# Altium schematic sheet Sensors.SchDoc
size A4
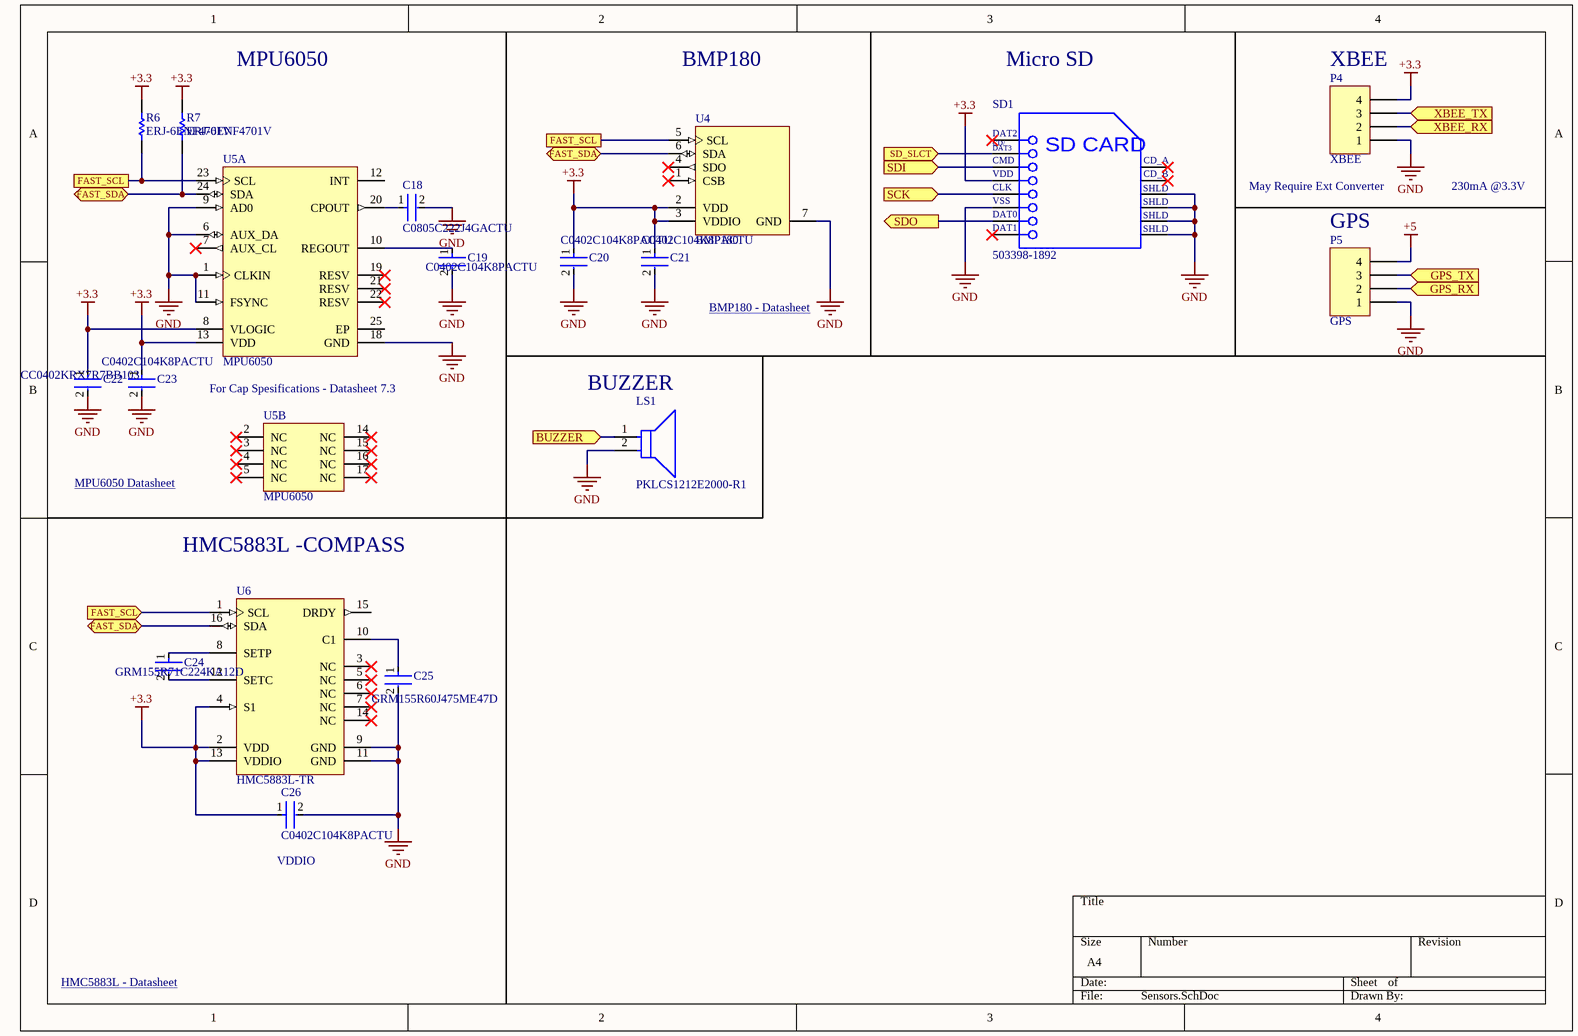
[diagram p0: Sensors.SchDoc]

## Parts
C18  C0805C222J4GACTU  [FP-C0805C-DN-MFG]
C19  C0402C104K8PACTU  [FP-C0402-BB-MFG]
C20  C0402C104K8PACTU  [FP-C0402-BB-MFG]
C21  C0402C104K8PACTU  [FP-C0402-BB-MFG]
C22  CC0402KRX7R7BB103  [FP-CC0402-MFG]
C23  C0402C104K8PACTU  [FP-C0402-BB-MFG]
C24  GRM155R71C224KA12D  [FP-GRM155-0_05-IPC_C]
C25  GRM155R60J475ME47D  [FP-GRM155-0_1-IPC_B]
C26  C0402C104K8PACTU  [FP-C0402-BB-MFG]
LS1  PKLCS1212E2000-R1  [FP-PKLCS1212E2000-R1-MFG]
P4  XBEE  [HDR1X4]
P5  GPS  [HDR1X4]
R6  ERJ-6ENF4701V  [RESC2013X70X40NL20T20]
R7  ERJ-6ENF4701V  [RESC2013X70X40NL20T20]
SD1  503398-1892  [MOLX-503398-1892_V]
U4  BMP180  [BOSC-BMP180-7_V]
U5  MPU6050  [INSE-QFN-24_V]  (parts A,B of 2)
U6  HMC5883L-TR  [HONEY-LPCC-16_V]

## Ports
BUZZER (in), FAST_SCL, FAST_SCL (in), FAST_SDA (bidir), GPS_RX (in), GPS_TX (in), SCK (in), SD_SLCT (in), SDI (in), SDO (out), XBEE_RX (in), XBEE_TX (in)

## Nets
+3.3: C20.1 C21.1 C22.1 C23.1 C26.1 P4.4 R6.2 R7.2 SD1.4(VDD) U4.2(VDD) U4.3(VDDIO) U5.8(VLOGIC) U5.13(VDD) U6.2(VDD) U6.4(S1) U6.13(VDDIO)
+5: P5.4
GND: C18.2 C19.2 C20.2 C21.2 C22.2 C23.2 C25.2 C26.2 LS1.2 P4.1 P5.1 SD1.6(VSS) SD1.11(SHLD) SD1.12(SHLD) SD1.13(SHLD) SD1.14(SHLD) U4.7(GND) U5.1(CLKIN) U5.6(AUX_DA) U5.9(AD0) U5.11(FSYNC) U5.18(GND) U6.9(GND) U6.11(GND)
BUZZER: LS1.1 ; port BUZZER
FAST_SCL: R6.1 U4.5(SCL) U5.23(SCL) U6.1(SCL) ; port FAST_SCL
FAST_SDA: R7.1 U4.6(SDA) U5.24(SDA) U6.16(SDA) ; port FAST_SDA
GPS_RX: P5.2 ; port GPS_RX
GPS_TX: P5.3 ; port GPS_TX
SCK: SD1.5(CLK) ; port SCK
SD_SLCT: SD1.2(CD/DAT3) ; port SD_SLCT
SDI: SD1.3(CMD) ; port SDI
SDO: SD1.7(DAT0) ; port SDO
XBEE_RX: P4.2 ; port XBEE_RX
XBEE_TX: P4.3 ; port XBEE_TX
NetC18_1: C18.1 U5.20(CPOUT)
NetC19_1: C19.1 U5.10(REGOUT)
NetC24_1: C24.1 U6.8(SETP)
NetC24_2: C24.2 U6.12(SETC)
NetC25_1: C25.1 U6.10(C1)

Not connected (* = marked no-connect by the designer): SD1 1(DAT2)* 8(DAT1)* 9(CD_A)* 10(CD_B)*; U4 1(CSB)* 4(SDO)*; U5 2(NC)* 3(NC)* 4(NC)* 5(NC)* 7(AUX_CL)* 12(INT) 14(NC)* 15(NC)* 16(NC)* 17(NC)* 19(RESV)* 21(RESV)* 22(RESV)* 25(EP); U6 3(NC)* 5(NC)* 6(NC)* 7(NC)* 14(NC)* 15(DRDY)

## Notes on the sheet
- MPU6050
- BMP180
- Micro SD
- (near P4) XBEE
- (near P4) May Require Ext Converter
- (near P5) GPS
- 230mA @3.3V
- BMP180 - Datasheet <https://media.digikey.com/pdf/Data%20Sheets/Bosch/BMP180.pdf?src-supplier=Digi-Key>
- (near U5) For Cap Spesifications - Datasheet 7.3
- (near LS1) BUZZER
- MPU6050 Datasheet <https://invensense.tdk.com/wp-content/uploads/2015/02/MPU-6000-Datasheet1.pdf>
- HMC5883L -COMPASS
- (near C26) VDDIO
- HMC5883L - Datasheet <https://cdn-shop.adafruit.com/datasheets/HMC5883L_3-Axis_Digital_Compass_IC.pdf>
- (in symbol CMP-2000-05621-1) CD/; DAT3; SD CARD

## Library data of the parts
C18 = CMP-03020-012538-1: Capacitor, Ceramic, 2.2Nf, 16Vdc, 5-% Tol, 5+% Tol, C0g-Tc Code, -30, 30Ppm-Tc Rohs Compliant: Yes; Manufacturer: KEMET; Voltage Rating: 16 V; Temperature Characteristic: C0G; VALUE: 2,200 pF; Tolerance: 0.05; Temperature Coefficient: 30ppm/°C; Material: Ceramic; Manufacturer Part Number: C0805C222J4GACTU; Octopart: https://octopart.com/c0805c222j4gactu-kemet-17052493; Device Class L3: Ceramic Capacitors; Temperature Range High: +125°C; Temperature Range Low: -55°C; Device Class L2: Capacitors; Package: C0805C-DN; ComponentLink2Description: Datasheet; Digikey Description: Capacitor, Ceramic, 2.2Nf, 16Vdc, 5-% Tol, 5+% Tol, C0g-Tc Code, -30, 30Ppm-Tc Rohs Compliant: Yes; ComponentLink2URL: https://content.kemet.com/datasheets/KEM_C1003_C0G_SMD.pdf; Device Class L1: Passive Components; Temperature: -55°C to +125°C; Height: 0.88mm; Capacitance: 2,200 pF; Automotive: No; RoHS: TRUE; Lead Free: Yes; Ipc Land Pattern Name: CAPC200125X78; Mouser Description: Capacitor, Ceramic, 2.2Nf, 16Vdc, 5-% Tol, 5+% Tol, C0g-Tc Code, -30, 30Ppm-Tc Rohs Compliant: Yes; Category: Cap
C19 C21 C23 C26 = CMP-2008-02046-2: CAP CER 0.1UF 10V X5R 0402; Manufacturer: Kemet; Material: Ceramic; Capacitance: 0.10 μF; Temperature Coefficient: 15%; Tolerance: 0.1; Value: 0.10 μF; Package: C0402-BB; Temperature: -55°C to +125°C; ComponentLink2Description: Datasheet; Temperature Characteristic: X5R; Device Class L1: Passive Components; Height: 0.55mm; Lead Free: Yes; ComponentLink2URL: https://content.kemet.com/datasheets/KEM_C1002_X7R_SMD.pdf; Device Class L2: Capacitors; Temperature Range Low: -55°C; Temperature Range High: +125°C; RoHS: TRUE; Octopart: https://octopart.com/c0402c104k8pactu-kemet-140039; Automotive: No; Mouser Description: Capacitor 100 nF 10 VDC 0402; Category: Cap; Voltage Rating: 10 V; Digikey Description: CAP CER 0.1UF 10V X5R 0402; Ipc Land Pattern Name: CAPC10050X50; Device Class L3: Ceramic Capacitors; Manufacturer Part Number: C0402C104K8PACTU
C20 = CMP-2008-02046-2: CAP CER 0.1UF 10V X5R 0402; Manufacturer: Kemet; Material: Ceramic; Capacitance: 0.10 μF; Temperature Coefficient: 15%; Tolerance: 0.1; VALUE: 0.10 µF; Package: C0402-BB; Temperature: -55°C to +125°C; ComponentLink2Description: Datasheet; Temperature Characteristic: X5R; Device Class L1: Passive Components; Height: 0.55mm; Lead Free: Yes; ComponentLink2URL: https://content.kemet.com/datasheets/KEM_C1002_X7R_SMD.pdf; Device Class L2: Capacitors; Temperature Range Low: -55°C; Temperature Range High: +125°C; RoHS: TRUE; Octopart: https://octopart.com/c0402c104k8pactu-kemet-140039; Automotive: No; Mouser Description: Capacitor 100 nF 10 VDC 0402; Category: Cap; Voltage Rating: 10 V; Digikey Description: CAP CER 0.1UF 10V X5R 0402; Ipc Land Pattern Name: CAPC10050X50; Device Class L3: Ceramic Capacitors; Manufacturer Part Number: C0402C104K8PACTU
C22 = CMP-03422-000501-1: CAP CER 10000PF 16V X7R 0402; Manufacturer: YAGEO; Automotive Grade: NA; Capacitance: 10 nF; Material: Ceramic; Value: 10 nF; Tolerance: 0.1; Temperature Coefficient: 30ppm/°C; Temperature Range Low: -55°C; Temperature Range High: +125°C; Mouser Description: 0402 10 nF 16 V ±10 % Tolerance X7R SMT Multilayer Ceramic Capacitor; Footprint Url: http://www.yageo.com/exep/pages/download/literatures/UPY-C_GEN_24.pdf; Category: Cap; RoHS: TRUE; Manufacturer Part Number: CC0402KRX7R7BB103; ComponentLink2Description: Datasheet; Ipc Land Pattern Name: CAPC10050X50; Automotive: No; ComponentLink2URL: http://www.yageo.com/documents/recent/UPY-GP_NP0_16V-to-50V_16.pdf; Device Class L1: Passive Components; Height: 0.55mm; Temperature Characteristic: X7R; Package: CC0402; Voltage Rating: 16 V; Device Class L3: Ceramic Capacitors; Lead Free: Yes; Device Class L2: Capacitors; Digikey Description: CAP CER 10000PF 16V X7R 0402; Octopart: https://octopart.com/cc0402krx7r7bb103-yageo-192895; Temperature: -55°C to +125°C
C24 = CMP-1034-02089-3: Chip Multilayer Ceramic Capacitors for General Purpose, 0402, 0.22uF, X7R, 15%, 10%, 16V; Capacitance: 220nF; Depth: 0.5mm; Dielectric: X7R; Min Operating Temperature: -55°C; Package Quantity: 1; Termination: SMD/SMT; Mount: Surface Mount; Radiation Hardening: No; Height: 0.5mm; Case Code (Metric): 1005; Packaging: Tape and Reel; Material: Ceramic; Voltage: 16V; Voltage Rating (DC): 16V; REACH SVHC: No SVHC; Voltage Rating: 16V; Length: 1mm; Tolerance: 10%; Thickness: 0.022inch; Case Code (Imperial): 0402; Max Operating Temperature: 125°C; Width: 0.02inch; Lead Free: Lead Free; Case/Package: 0402
C25 = CMP-2008-04549-2: Chip Multilayer Ceramic Capacitors for General Purpose, 0402, 4.7uF, X5R, 15%, 20%, 6.3V; Height: 0.5mm; Weight: 0.000212oz; Length: 1mm; Case Code (Metric): 1005; Packaging: Tape and Reel; Termination: SMD/SMT; Dielectric: X5R; Depth: 0.5mm; Case Code (Imperial): 0402; Min Operating Temperature: -55°C; Case/Package: 0402; Voltage: 6.3V; Width: 0.02inch; Capacitance: 4.7uF; Lead Free: Lead Free; Thickness: 0.022inch; Contact Plating: Tin; REACH SVHC: No SVHC; Package Quantity: 10000; Tolerance: 20%; Voltage Rating (DC): 6.3V; Voltage Rating: 6.3V; Mount: Surface Mount; Max Operating Temperature: 85°C
LS1 = CMP-06202-000001-1: AUDIO PIEZO TRANSDUCER 12.5V SMD; Manufacturer: Murata; Frequency: 2kHz; Digikey Description: AUDIO PIEZO TRANSDUCER 12.5V SMD; RoHS: TRUE; Device Class L3: Buzzers; Manufacturer Part Number: PKLCS1212E2000-R1; Automotive: No; Category: Speak; Height: 3mm; Operating Supply Voltage: 12.5V; Mouser Description: Piezo buzzer SMD; Temperature Range High: +70°C; Temperature Range Low: -20°C; ComponentLink2Description: Datasheet; ComponentLink2URL: https://www.murata.com/en-global/products/productdata/8801054425118/SPEC-PKLCS1212E2000-R1.pdf?1517839212000; Package: PKLCS1212E2000-R1; Device Class L1: Electromechanical; Device Class L2: Audio Products; Lead Free: Yes; Temperature: -20°C to +70°C; Octopart: https://octopart.com/pklcs1212e2000-r1-murata-7123179
P4 P5 = Header 4: Header, 4-Pin; LatestRevisionDate: 17-Jul-2002; LatestRevisionNote: Re-released for DXP Platform.; Publisher: Altium Limited
R6 R7 = CMP-2001-00550-5: Chip Resistor, 4.7 KOhm, +/- 1%, 0.125 W, -55 to 155 degC, 0805 (2012 Metric), RoHS, Tape and Reel; Manufacturer: Panasonic; Voltage Rating: 150 V; Min Operating Temperature: -55 degC; PackageReference: 0805; Mounting Technology: Surface Mount; Height: 0.6 mm; PackageDescription: 2-Pin Surface Mount Device, Body 2 x 1.25 mm; RoHSCompliant: true; Length: 2 mm; REACH SVHC: Yes; Packaging: Tape and Reel; Pins: 2; Mount: Surface Mount; ComponentLink2Description: Datasheet; ComponentLink1URL: http://www.panasonic.com/; ComponentLink1Description: Manufacturer URL; DatasheetVersion: 04/2015; Package Quantity: 5000; ComponentLink2URL: http://industrial.panasonic.com/cdbs/www-data/pdf/RDA0000/AOA0000C86.pdf; Max Operating Temperature: 155 degC
SD1 = CMP-2000-05621-1: Micro SD Connector, Pitch 1.1 mm, 8 Position, Height 1.4 mm, -25 to 85 degC, RoHS, Tape and Reel; Manufacturer: Molex; Voltage Rating: 10VAC/DC; Current Rating: 500mA; Manufacturer URL: http://www.molex.com/; Package Reference: 503398-1892; Packaging: Reel; RoHS: Details; Brand: Molex; Datasheet URL: http://www.molex.com/pdm_docs/sd/5033981892_sd.pdf; Mounting Technology: SurfaceMount; Factory Pack Quantity: 2400; Datasheet Version: Rev. E, 04/2006; Series: 503398; Product Category: MemoryCardConnectors; Package Description: Micro SD Connector, Pitch 1.1 mm, 8 Position, Height 1.4 mm
U4 = CMP-2000-05074-1: Digital Pressure Sensor, 1.8 to 3.6 V, -40 to 85 degC, 7-Pin LGA, RoHS; Manufacturer: Bosch Sensortec; Output Type: I²C; Other Names: 0273.300.244-1NV / 828-1027-2; Pressure Type: Absolute; Maximum Pressure: 145.04PSI(1000kPa); Voltage - Supply: 1.62V~3.6V; EDA / CAD Models: DownloadfromAcceleratedDesigns; Accuracy: ±2%; Port Style: NoPort; For Use With: 1528-1434-ND / -BMP180BAROMETRICPRESS/TEMP5V / 1528-1435-ND / -L3GD20HLSM303BMP18010DOFIMU / 1568-1260-ND / -SPARKFUNBAROMETRICPRESSURESEN / 1597-1301-ND / -GROVEBAROMETERSENSOR / 1597-1302-ND / -GROVEIMU10DOF / 1471-1581-ND / -10DOFCLICK / 101040003-ND / -XADOWBAROMETERBMP180V1.0 / 101040004-ND / -XADOW-IMU10DOF / 114990245-ND / -BOARDTPHPRESSURETEMPREV.4 / 828-1028-ND / -BMP180SHUTTLEBOARDFORDEVKIT / 103990031-ND / -TPHBOARDTHETEMPERATUREPRESSU; Operating Pressure: 4.35PSI~15.95PSI(30kPa~110kPa); Output: 16~19b; Supplier Device Package: 7-LGA; Operating Temperature: -40degC~85degC; Standard Package: 5,000; Package / Case: 7-VLGA; Manufacturer URL: http://www.bosch-sensortec.com; Category: Sensors,Transducers; Datasheet URL: http://media.digikey.com/pdf/Data%20Sheets/Bosch/BMP180.pdf; Family: PressureSensors,Transducers; Termination Style: PCB; Datasheet Version: Rev. 2.4, 01/2012
U5 = CMP-1753-00002-1: 3-Axis Gyroscope, 3-Axis Accelerometer / , 2.375 to 3.46 V, -40 to 105 degC, 24-Pin QFN, RoHS, Tape and Reel; Resistance: 5.6 kohm; Tolerance: 1%; Voltage Rating: 75 V; Power Rating: 100 mW; ComponentLink1Description: Manufacturer URL; Mount: Surface Mount; Max Operating Temperature: 155degC; Package Quantity: 5000; ComponentLink2Description: Datasheet; Pins: 2; Packaging: Tape and Reel; Case Code (Imperial): 0603; PackageReference: QFN-24; ComponentLink2URL: https://datasheet.ciiva.com/1513/1788002-1513632.pdf; Radiation Hardening: No; ComponentLink1URL: http://www.invensense.com/; PackageDescription: 24-Pin Quad Flat No-lead Package, Body 4 x 4 mm, Pitch 0.5 mm; Height: 0.45 mm; Case/Package: 0603; Case Code (Metric): 1608; REACH SVHC: Yes; Min Operating Temperature: -55degC; DatasheetVersion: Rev. 3.4, 08/2013; Width: 0.8 mm; RoHSCompliant: True; Length: 1.6 mm
U6 = CMP-2000-05148-1: Three-Axis Digital Compass IC, 2.16 to 3.6 V, -30 to 85 degC, 16-Pin PLCC, RoHS, Tape and Reel; Manufacturer: Honeywell; Dynamic Catalog: HMCSeries; Other Names: 342-1082-6; Sensing Range: ±8G; Current - Supply: 100µA; Output Type: DifferentialVoltage; Product Training Modules: HMC5883LThreeAxisCompassIC; Voltage - Supply: 2.16V~3.6V; Product Change Notification: HMC5883L-TRIdleCurrentChange13/Apr/2012; Supplier Device Package: 16-LCC; Features: Compass-ThreeAxis; Package / Case: 16-LCC; Datasheet Version: Rev. C, 04/2012; Category: Sensors,Transducers; Packaging: Digi-Reel; Series: HMC; Type: Compass-ThreeAxis; Family: MagneticSensors-HallEffect,DigitalSwitch,Linear,Compass(ICs); Operating Temperature: -30degC~85degC; Standard Package: 1; Manufacturer URL: http://honeywell.com/Pages/Home.aspx; Datasheet URL: https://datasheet.ciiva.com/1314/1683374-1314148.pdf